# EAGLE design KE04 (EAGLE 7.1.0)
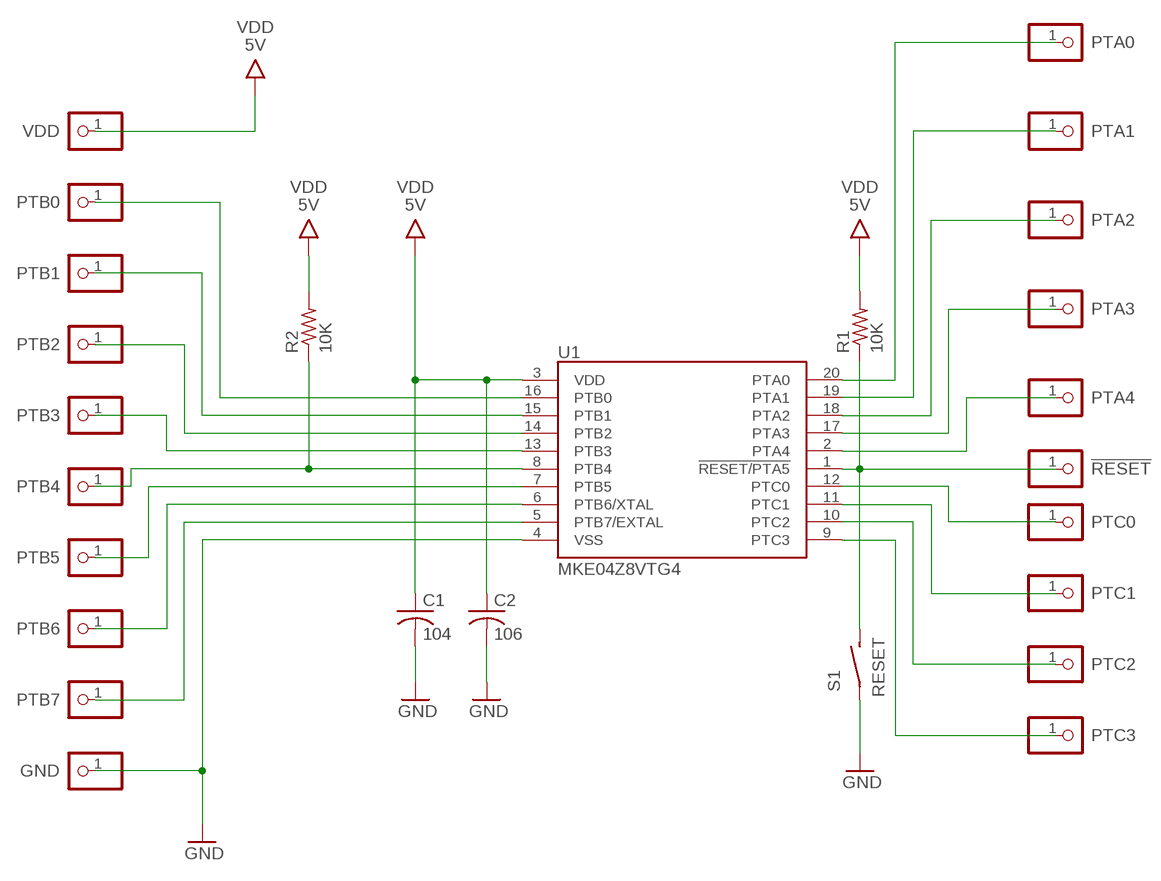
[diagram p0: schematic, sheet 1]

## Parts
C1  104  C-0603  [0603]
C2  106  C-1206  [1206]
JP1  !RESET  PINHD-1X01_2.54-S  [1X01-S]
JP2  PTA4  PINHD-1X01_2.54-S  [1X01-S]
JP3  VDD  PINHD-1X01_2.54-S  [1X01-S]
JP4  GND  PINHD-1X01_2.54-S  [1X01-S]
JP5  PTB7  PINHD-1X01_2.54-S  [1X01-S]
JP6  PTB6  PINHD-1X01_2.54-S  [1X01-S]
JP7  PTB5  PINHD-1X01_2.54-S  [1X01-S]
JP8  PTB4  PINHD-1X01_2.54-S  [1X01-S]
JP9  PTC3  PINHD-1X01_2.54-S  [1X01-S]
JP10  PTC2  PINHD-1X01_2.54-S  [1X01-S]
JP11  PTC1  PINHD-1X01_2.54-S  [1X01-S]
JP12  PTC0  PINHD-1X01_2.54-S  [1X01-S]
JP13  PTB3  PINHD-1X01_2.54-S  [1X01-S]
JP14  PTB2  PINHD-1X01_2.54-S  [1X01-S]
JP15  PTB1  PINHD-1X01_2.54-S  [1X01-S]
JP16  PTB0  PINHD-1X01_2.54-S  [1X01-S]
JP17  PTA3  PINHD-1X01_2.54-S  [1X01-S]
JP18  PTA2  PINHD-1X01_2.54-S  [1X01-S]
JP19  PTA1  PINHD-1X01_2.54-S  [1X01-S]
JP20  PTA0  PINHD-1X01_2.54-S  [1X01-S]
R1  10K  R0603  [0603]
R2  10K  R0603  [0603]
S1  RESET  SPST_3X4X2  [3X4X2TACT]
U1  MKE04Z8VTG4  [TSSOP20]

## Nets
GND: C1.2(-) C2.2(-) JP4.1 S1.P$1(P) U1.4(VSS)
N$1: JP5.1 U1.5(PTB7/EXTAL)
N$3: JP6.1 U1.6(PTB6/XTAL)
N$4: JP7.1 U1.7(PTB5)
N$5: JP8.1 R2.1 U1.8(PTB4)
N$7: JP9.1 U1.9(PTC3)
N$8: JP10.1 U1.10(PTC2)
N$9: JP11.1 U1.11(PTC1)
N$10: JP12.1 U1.12(PTC0)
N$12: JP13.1 U1.13(PTB3)
N$13: JP14.1 U1.14(PTB2)
N$14: JP15.1 U1.15(PTB1)
N$15: JP16.1 U1.16(PTB0)
N$16: JP17.1 U1.17(PTA3)
N$17: JP18.1 U1.18(PTA2)
N$18: JP19.1 U1.19(PTA1)
PTA0: JP20.1 U1.20(PTA0)
PTA4: JP2.1 U1.2(PTA4)
PTA5: JP1.1 R1.1 S1.P$2(S) U1.1(!RESET/PTA5)
VDD: C1.1(+) C2.1(+) JP3.1 R1.2 R2.2 U1.3(VDD) ; supply symbol labelled 5V

## Library data of the parts
C1 C2 = bt_rcl:C: Capacitor, non-polarized, American symbol
JP1-JP20 = bt_electromech:PINHD-1X01: PIN HEADER Generic pin header in a variety of footprints
R1 R2 = bt_rcl:R: Resistor, American symbol
S1 = bt_electromech:SPST: SPST SWITCH
U1 = bt_arm:MKE04Z8VTG4: Kinetis KE04 ARM Cortex M0+ Datasheet.pdf <http://cache.freescale.com/files/microcontrollers/doc/data_sheet/MKE04P24M48SF0.pdf> The MKE04Z8VTG4 is a 32-bit ARM Cortex M0+ that runs up to 48MHz on 2.7-5.5V with 8KB Flash, 1KB RAM, 4-24MHz crystal/ceramic resonator, 32.768kHz crystal resonator, and other clock options. Other features include: Power management module (PMC) with three power modes: Run, Wait, Stop Low-voltage detection (LVD) with reset or interrupt, selectable trip points Watchdog with independent clock source (WDOG) Programmable cyclic redundancy check module (CRC) Serial wire debug interface (SWD) Aliased SRAM bitband region (BIT-BAND) Bit manipulation engine (BME) 80-bit unique identification (ID) number per chip Up to 22 general-purpose input/output (GPIO) Two 8-bit keyboard interrupt modules (KBI) External interrupt (IRQ) One 12-channel 12-bit SAR ADC, operation in Stop mode, optional hardware trigger (ADC) Two analog comparators containing a 6-bit DAC and programmable reference input (ACMP) One 6-channel FlexTimer/PWM (FTM) One 2-channel FlexTimer/PWM (FTM) One 2-channel periodic interrupt timer (PIT) One pulse width timer (PWT) One real-time clock (RTC) One SPI module (SPI) One UART module (UART) One I2C module (I2C)

## Board
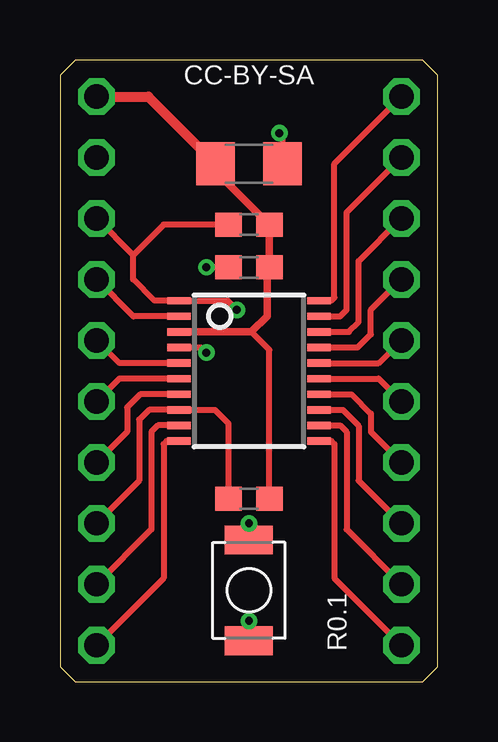
[diagram p1: board, top side]
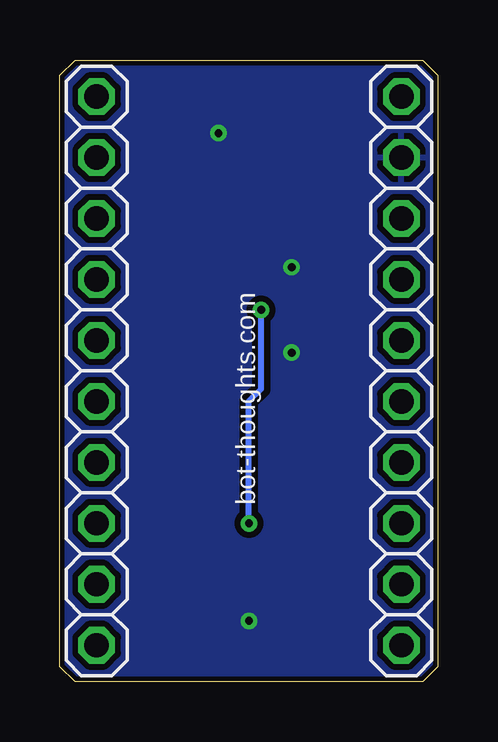
[diagram p2: board, bottom side, seen from below]

Size 15.75 x 25.91 mm. Coordinates in mm from the lower left corner, seen from the top.
Outline: 0,25.27 0,0.64 0.64,0 15.11,0 15.75,0.64 15.75,25.27 15.11,25.91 0.64,25.91 0,25.27
Copper layers (1*16): Top 0.0356mm / dielectric 1.5011mm / Bottom 0.0356mm
Design rules "LaenPCBOrder *": minimum track width 6mil, minimum drill 13mil, track to track 10mil, track to pad 10mil, pad to pad 10mil, via to via 10mil, smd to smd 8mil, copper to edge 8mil, drill to drill 8mil, minimum pad ring 7mil, minimum via ring 7mil, stop-mask expansion 3mil, vias tented up to drill 20mil, thermal gap 10mil

### Footprints (pad centres in the part's own frame; a part is rotated, then mirrored left to right if it is on the bottom)
0603 = smd 1.1 x 1: 1 -0.85,0; 2 0.85,0
1206 = smd 1.6 x 1.8: 1 -1.4,0; 2 1.4,0
1X01-S = drill 1.016 octagon: 1 0,0
3X4X2TACT = smd 1.2 x 2: P$1 -2.1,0; P$2 2.1,0
TSSOP20 = smd 0.305 x 0.991: 1 -2.925,-2.918; 2 -2.275,-2.918; 3 -1.625,-2.918; 4 -0.975,-2.918; 5 -0.325,-2.918; 6 0.325,-2.918; 7 0.975,-2.918; 8 1.625,-2.918; 9 2.275,-2.918; 10 2.925,-2.918; 11 2.925,2.918; 12 2.275,2.918; 13 1.625,2.918; 14 0.975,2.918; 15 0.325,2.918; 16 -0.325,2.918; 17 -0.975,2.918; 18 -1.625,2.918; 19 -2.275,2.918; 20 -2.925,2.918

### Placement (x,y rotation side)
C1  7.87,17.27 180 top
C2  7.87,21.59 0 top
JP1  1.52,19.3 180 bottom
JP2  1.52,16.76 180 bottom
JP3  1.52,24.38 180 bottom
JP4  1.52,21.84 180 bottom
JP5  1.52,14.22 180 bottom
JP6  1.52,11.68 180 bottom
JP7  1.52,9.14 180 bottom
JP8  1.52,6.6 180 bottom
JP9  1.52,4.06 180 bottom
JP10  1.52,1.52 180 bottom
JP11  14.22,1.52 0 bottom
JP12  14.22,4.06 0 bottom
JP13  14.22,6.6 0 bottom
JP14  14.22,9.14 0 bottom
JP15  14.22,11.68 0 bottom
JP16  14.22,14.22 0 bottom
JP17  14.22,16.76 0 bottom
JP18  14.22,19.3 0 bottom
JP19  14.22,21.84 0 bottom
JP20  14.22,24.38 0 bottom
R1  7.87,19.05 0 top
R2  7.87,7.62 0 top
S1  7.87,3.81 90 top
U1  7.87,12.95 270 top

### Tracks (layer width: path | path; a pad name or v marks a point on that pad's centre or on a via)
GND  (via drill 0.33)
  Top 0.254: C1.2 v6.1,17.27 | C2.2 9.27,22.73 v9.14,22.86 | U1.4 5.88,13.93 v6.1,13.72 | S1.P$1 v7.87,2.54
  pour Bottom: 15.11,0 0.64,0 0,0.64 0,25.27 0.64,25.91 15.11,25.91 15.75,25.27 15.75,0.64
N$1
  Top 0.254: U1.5 2.47,13.28 JP5.1
N$3
  Top 0.254: U1.6 2.47,12.63 JP6.1
N$4
  Top 0.254: U1.7 3.34,11.98 2.79,11.43 2.79,10.41 JP7.1
N$5
  Top 0.254: JP8.1 3.3,8.38 3.3,10.92 3.71,11.33 U1.8 6.45,11.33 7.02,10.76 R2.1
N$7
  Top 0.254: U1.9 4.08,10.68 3.81,10.41 3.81,6.35 JP9.1
N$8
  Top 0.254: U1.10 4.44,10.03 4.32,9.91 4.32,4.32 JP10.1
N$9
  Top 0.254: U1.11 11.31,10.03 11.43,9.91 11.43,4.32 JP11.1
N$10
  Top 0.254: U1.12 11.67,10.68 11.94,10.41 11.94,6.35 JP12.1
N$12
  Top 0.254: U1.13 11.79,11.33 12.45,10.67 12.45,8.38 JP13.1
N$13
  Top 0.254: U1.14 12.15,11.98 12.95,11.18 12.95,10.41 JP14.1
N$14
  Top 0.254: U1.15 13.28,12.63 JP15.1
N$15
  Top 0.254: U1.16 13.28,13.28 JP16.1
N$16
  Top 0.254: U1.17 12.4,13.93 12.95,14.48 12.95,15.49 JP17.1
N$17
  Top 0.254: U1.18 12.04,14.58 12.45,14.99 12.45,17.53 JP18.1
N$18
  Top 0.254: U1.19 11.67,15.23 11.94,15.49 11.94,19.56 JP19.1
PTA0
  Top 0.254: U1.20 11.31,15.88 11.43,16 11.43,21.59 JP20.1
PTA4
  Top 0.254: U1.2 3.06,15.23 JP2.1
PTA5  (via drill 0.33)
  Top 0.254: 3.05,17.78 3.05,16.76 3.93,15.88 U1.1 6.98,15.88 v7.37,15.49 | 3.05,17.78 JP1.1 | R1.1 4.32,19.05 3.05,17.78 | S1.P$2 v7.87,6.6
  Bottom 0.254: v7.87,6.6 7.87,11.68 7.37,12.19 v7.37,15.49
VDD
  Top 0.254: R2.2 8.72,13.83 7.97,14.58
  Top 0.305: U1.3 7.97,14.58 8.64,15.24 8.64,17.11 C1.1 R1.2 6.47,21.3 C2.1
  Top 0.406: JP3.1 3.68,24.38 C2.1

### Text on the board
tPlace: CC-BY-SA | R0.1
bPlace: bot-thoughts.com